# EAGLE schematic Laser Tag Reloaded schematic (EAGLE 6.2)
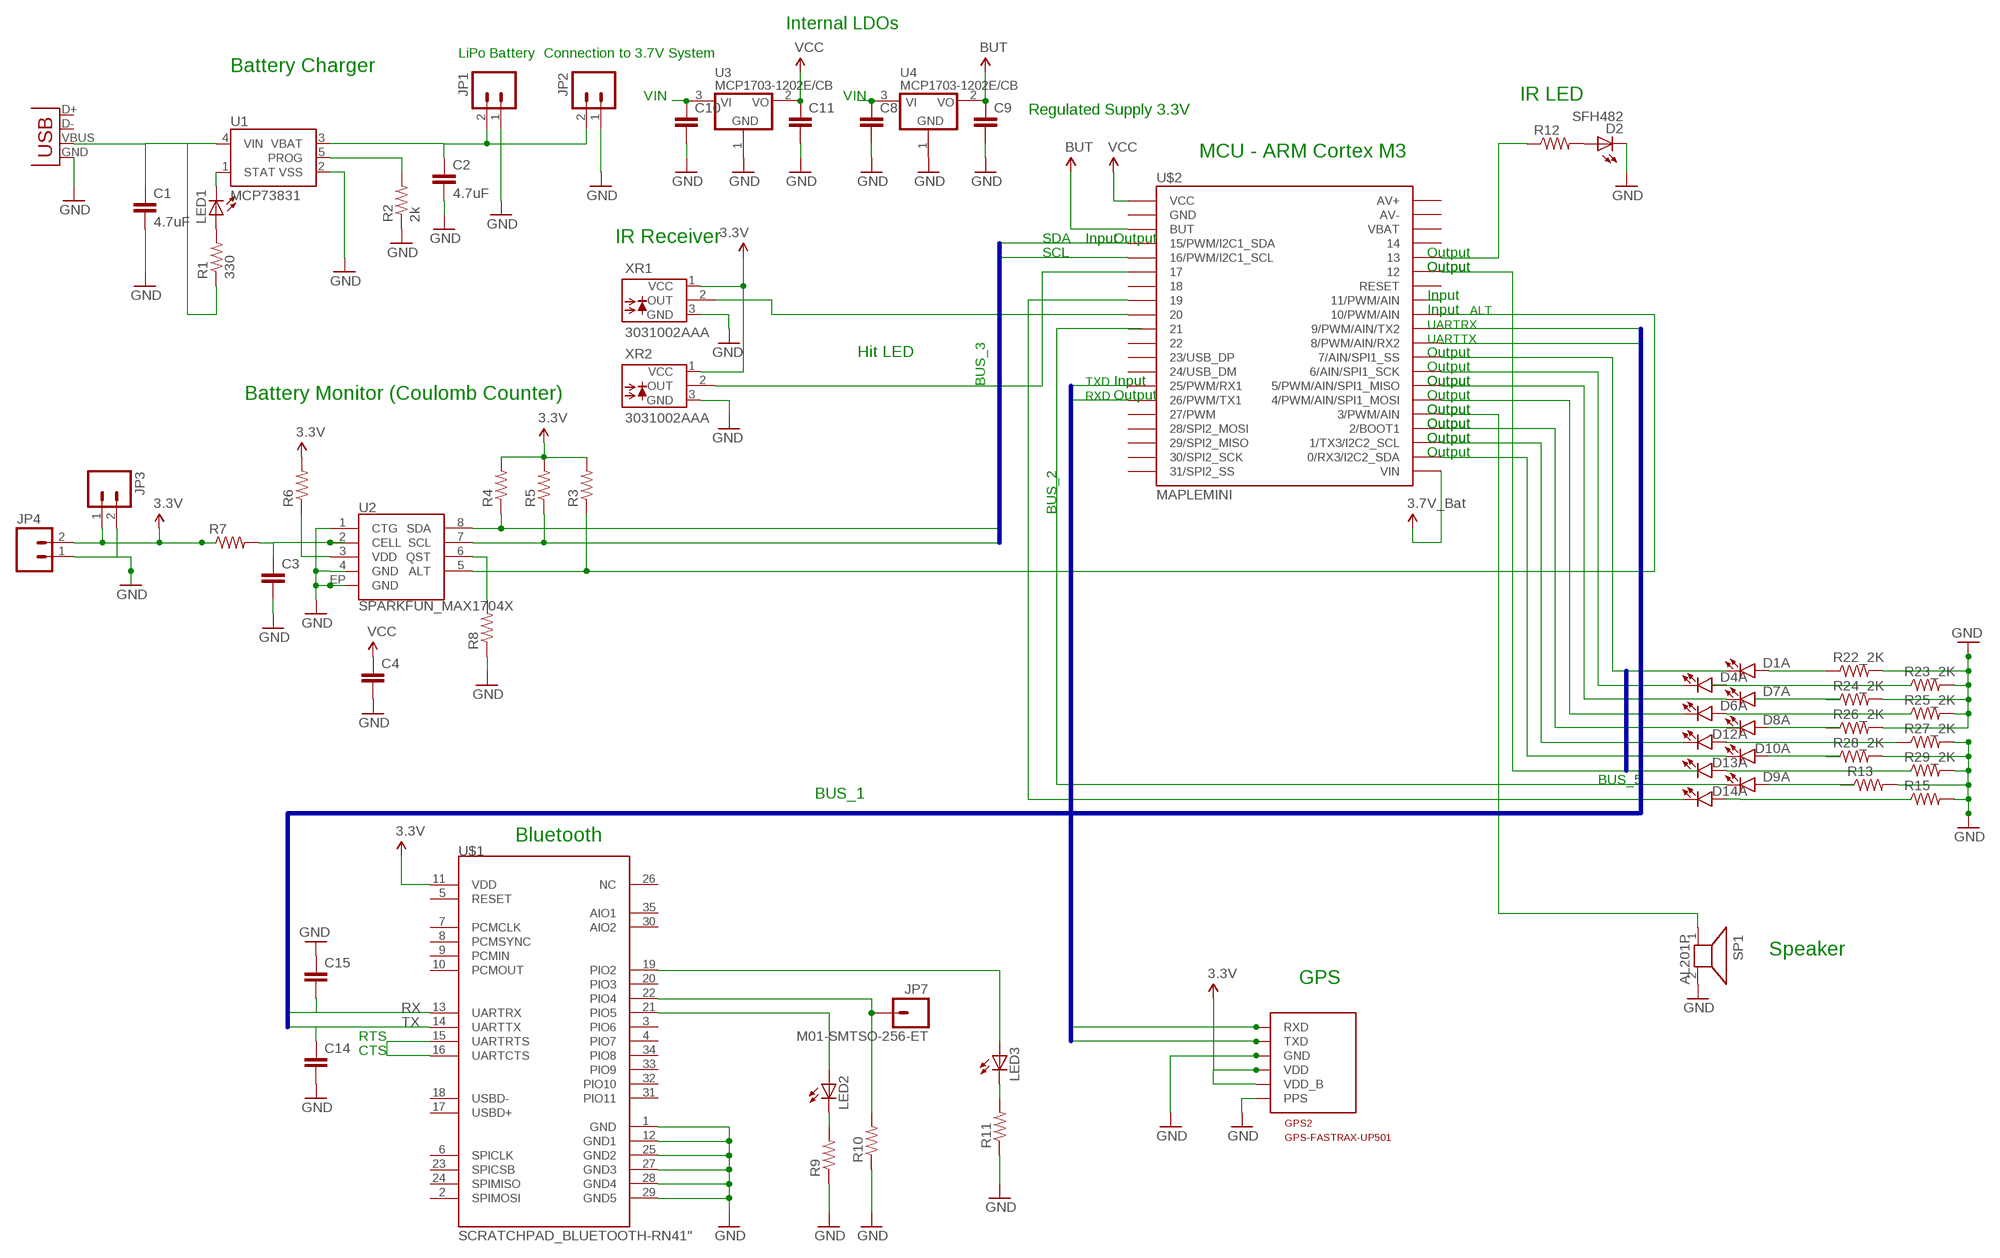
[diagram p0: schematic, sheet 1]

## Parts
C1  4.7uF  SPARKFUN_CAP0402-CAP  [SPARKFUN_0402-CAP]
C2  4.7uF  SPARKFUN_CAP0402-CAP  [SPARKFUN_0402-CAP]
C3  SPARKFUN_CAP0402-CAP  [SPARKFUN_0402-CAP]
C4  SPARKFUN_CAP0402-CAP  [SPARKFUN_0402-CAP]
C8  SPARKFUN_CAP0402-CAP  [SPARKFUN_0402-CAP]
C9  SPARKFUN_CAP0402-CAP  [SPARKFUN_0402-CAP]
C10  SPARKFUN_CAP0402-CAP  [SPARKFUN_0402-CAP]
C11  SPARKFUN_CAP0402-CAP  [SPARKFUN_0402-CAP]
C14  SPARKFUN_CAP0402-CAP  [SPARKFUN_0402-CAP]
C15  SPARKFUN_CAP0402-CAP  [SPARKFUN_0402-CAP]
D1  SPARKFUN_LED_BARGRAPH_10  [SPARKFUN_LED_BARGAPH_10]
D2  SFH482  [SFH482]
D4  SPARKFUN_LED_BARGRAPH_10  [SPARKFUN_LED_BARGAPH_10]
D6  SPARKFUN_LED_BARGRAPH_10  [SPARKFUN_LED_BARGAPH_10]
D7  SPARKFUN_LED_BARGRAPH_10  [SPARKFUN_LED_BARGAPH_10]
D8  SPARKFUN_LED_BARGRAPH_10  [SPARKFUN_LED_BARGAPH_10]
D9  SPARKFUN_LED_BARGRAPH_10  [SPARKFUN_LED_BARGAPH_10]
D10  SPARKFUN_LED_BARGRAPH_10  [SPARKFUN_LED_BARGAPH_10]
D12  SPARKFUN_LED_BARGRAPH_10  [SPARKFUN_LED_BARGAPH_10]
D13  SPARKFUN_LED_BARGRAPH_10  [SPARKFUN_LED_BARGAPH_10]
D14  SPARKFUN_LED_BARGRAPH_10  [SPARKFUN_LED_BARGAPH_10]
GPS2  GPS-FASTRAX-UP501  [GPS-FASTRAX-UP501]
JP1  SPARKFUN_M02-JST-2MM-SMT  [SPARKFUN_JST-2-SMD]
JP2  SPARKFUN_M02-JST-2MM-SMT  [SPARKFUN_JST-2-SMD]
JP3  SPARKFUN_M02-JST-2-PTH-NO_SILK  [SPARKFUN_JST-2-PTH-NS]
JP4  SPARKFUN_M02-JST-2-PTH-NO_SILK  [SPARKFUN_JST-2-PTH-NS]
JP7  M01-SMTSO-256-ET  SPARKFUN_M01-SMTSO-256-ET  [SPARKFUN_SMTSO-256-ET]
LED1  SPARKFUN_LED3MM  [SPARKFUN_LED3MM]
LED2  SPARKFUN_LED3MM  [SPARKFUN_LED3MM]
LED3  SPARKFUN_LED3MM  [SPARKFUN_LED3MM]
R1  330  SPARKFUN_RESISTOR0402-RES  [SPARKFUN_0402-RES]
R2  2k  SPARKFUN_RESISTOR0402-RES  [SPARKFUN_0402-RES]
R3  SPARKFUN_RESISTOR0402-RES  [SPARKFUN_0402-RES]
R4  SPARKFUN_RESISTOR0402-RES  [SPARKFUN_0402-RES]
R5  SPARKFUN_RESISTOR0402-RES  [SPARKFUN_0402-RES]
R6  SPARKFUN_RESISTOR0402-RES  [SPARKFUN_0402-RES]
R7  SPARKFUN_RESISTOR0402-RES  [SPARKFUN_0402-RES]
R8  SPARKFUN_RESISTOR0402-RES  [SPARKFUN_0402-RES]
R9  SPARKFUN_RESISTOR  [SPARKFUN_0805]
R10  SPARKFUN_RESISTOR  [SPARKFUN_0805]
R11  SPARKFUN_RESISTOR  [SPARKFUN_0805]
R12  SPARKFUN_RESISTOR0402-RES  [SPARKFUN_0402-RES]
R13  R-US_0204/2V  [0204V]
R15  R-US_0204/2V  [0204V]
R22_2K  SPARKFUN_RESISTOR0402-RES  [SPARKFUN_0402-RES]
R23_2K  SPARKFUN_RESISTOR0402-RES  [SPARKFUN_0402-RES]
R24_2K  SPARKFUN_RESISTOR0402-RES  [SPARKFUN_0402-RES]
R25_2K  SPARKFUN_RESISTOR0402-RES  [SPARKFUN_0402-RES]
R26_2K  SPARKFUN_RESISTOR0402-RES  [SPARKFUN_0402-RES]
R27_2K  SPARKFUN_RESISTOR0402-RES  [SPARKFUN_0402-RES]
R28_2K  SPARKFUN_RESISTOR0402-RES  [SPARKFUN_0402-RES]
R29_2K  SPARKFUN_RESISTOR0402-RES  [SPARKFUN_0402-RES]
SP1  AL201P  [AL201P]
U1  MCP73831  SPARKFUN_MCP73831  [SPARKFUN_SOT23-5]
U2  SPARKFUN_MAX1704X  [SPARKFUN_TDFN-8]
U3  MCP1703-1202E/CB  [SOT23A_MICROCHIP_CB]
U4  MCP1703-1202E/CB  [SOT23A_MICROCHIP_CB]
U$1  SCRATCHPAD_BLUETOOTH-RN41"  [SCRATCHPAD_RN41]
U$2  MAPLEMINI  [20-DIP]
X2  SPARKFUN_USB-A-S  [SPARKFUN_USB-A-S]
XR1  3031002AAA  [AAA-3]
XR2  3031002AAA  [AAA-3]

## Nets
GND: C1.2 C2.2 C3.2 C4.2 C8.2 C9.2 C10.2 C11.2 C14.2 C15.1 D2.K(C) GPS2.GND GPS2.PPS JP1.1 JP2.1 R2.1 R8.1 R9.1 R10.1 R11.1 R13.2 R15.2 R22_2K.2 R23_2K.2 R24_2K.2 R25_2K.2 R26_2K.2 R27_2K.2 R28_2K.2 R29_2K.2 SP1.2 U1.2(VSS) U2.1(CTG) U2.4(GND) U2.EP(GND) U3.1(GND) U4.1(GND) U$1.1(GND) U$1.12(GND1) U$1.25(GND2) U$1.27(GND3) U$1.28(GND4) U$1.29(GND5) X2.GND XR1.3(GND) XR2.3(GND)
N$1: LED1.A R1.2
N$2: C1.1 R1.1 U1.4(VIN) X2.VBUS
N$3: C2.1 JP1.2 JP2.2 U1.3(VBAT)
N$4: LED1.K(C) U1.1(STAT)
N$5: R2.2 U1.5(PROG)
N$6: R4.1 U2.8(SDA)
N$7: JP3.2 JP4.1 ; supply symbol labelled GND
N$8: C3.1 R7.2 U2.2(CELL)
N$9: R6.1 U2.3(VDD)
N$10: R5.1 U2.7(SCL)
N$11: R8.2 U2.6(QST)
N$12: LED2.K(C) R9.2
N$13: D9.20(A:C)
N$14: LED3.K(C) R11.2
N$15: LED2.A U$1.21(PIO5)
N$16: JP7.P$1 R10.2 U$1.22(PIO4)
N$17: LED3.A U$1.19(PIO2)
N$18: D14.20(A:C) U$2.8
N$19: D14.1(A:A) R15.1
N$20: D1.1(A:A) R22_2K.1
N$22: D6.1(A:A)
N$23: D8.1(A:A)
N$24: D12.1(A:A) R27_2K.1
N$25: GPS2.TXD
N$26: GPS2.RXD
N$28: D2.A R12.2
N$29: U$2.4(15/PWM/I2C1_SDA)
N$30: R12.1 U$2.36
N$31: U$2.5(16/PWM/I2C1_SCL)
N$33: U$2.31(9/PWM/AIN/TX2)
N$34: U$2.30(8/PWM/AIN/RX2)
N$35: U$2.14(25/PWM/RX1)
N$36: U$2.15(26/PWM/TX1)
N$37: D10.1(A:A)
N$38: D13.1(A:A)
N$39: D9.1(A:A)
N$46: D6.20(A:C) U$2.26(4/PWM/AIN/SPI1_MOSI)
N$48: C10.1 U3.3(VI)
N$49: C8.1 U4.3(VI)
N$50: R3.1 U2.5(ALT) U$2.32(10/PWM/AIN)
N$52: D7.20(A:C) U$2.27(5/PWM/AIN/SPI1_MISO)
N$53: D4.20(A:C) U$2.28(6/AIN/SPI1_SCK)
N$54: D1.20(A:C) U$2.29(7/AIN/SPI1_SS)
N$55: SP1.1 U$2.25(3/PWM/AIN)
N$56: U$2.9 XR1.2(OUT)
N$64: U$2.35
N$66: D10.20(A:C) U$2.22(0/RX3/I2C2_SDA)
N$69: R24_2K.1
N$71: U$2.24(2/BOOT1)
N$72: D12.20(A:C) U$2.23(1/TX3/I2C2_SCL)
N$78: U$2.6 XR2.2(OUT)
N$101: U$2.33(11/PWM/AIN)
RTS: U$1.15(UARTRTS) U$1.16(UARTCTS)
RX: C15.2 U$1.13(UARTRX)
TX: C14.1 U$1.14(UARTTX)
VCC: C4.1 C9.1 C11.1 GPS2.VDD GPS2.VDD_B JP3.1 JP4.2 R3.2 R4.2 R5.2 R6.2 R7.1 U3.2(VO) U4.2(VO) U$1.11(VDD) U$2.1(VCC) U$2.3(BUT) U$2.21(VIN) XR1.1(VCC) XR2.1(VCC) ; supply symbol labelled 3.3V, 3.7V_Bat, BUT
Unconnected: D1.2(B:A) D1.3(C:A) D1.4(D:A) D1.5(E:A) D1.6(F:A) D1.7(G:A) D1.8(H:A) D1.9(I:A) D1.10(J:A) D1.11(J:C) D1.12(I:C) D1.13(H:C) D1.14(G:C) D1.15(F:C) D1.16(E:C) D1.17(D:C) D1.18(C:C) D1.19(B:C) D4.1(A:A) D4.2(B:A) D4.3(C:A) D4.4(D:A) D4.5(E:A) D4.6(F:A) D4.7(G:A) D4.8(H:A) D4.9(I:A) D4.10(J:A) D4.11(J:C) D4.12(I:C) D4.13(H:C) D4.14(G:C) D4.15(F:C) D4.16(E:C) D4.17(D:C) D4.18(C:C) D4.19(B:C) D6.2(B:A) D6.3(C:A) D6.4(D:A) D6.5(E:A) D6.6(F:A) D6.7(G:A) D6.8(H:A) D6.9(I:A) D6.10(J:A) D6.11(J:C) D6.12(I:C) D6.13(H:C) D6.14(G:C) D6.15(F:C) D6.16(E:C) D6.17(D:C) D6.18(C:C) D6.19(B:C) D7.1(A:A) D7.2(B:A) D7.3(C:A) D7.4(D:A) D7.5(E:A) D7.6(F:A) D7.7(G:A) D7.8(H:A) D7.9(I:A) D7.10(J:A) D7.11(J:C) D7.12(I:C) D7.13(H:C) D7.14(G:C) D7.15(F:C) D7.16(E:C) D7.17(D:C) D7.18(C:C) D7.19(B:C) D8.2(B:A) D8.3(C:A) D8.4(D:A) D8.5(E:A) D8.6(F:A) D8.7(G:A) D8.8(H:A) D8.9(I:A) D8.10(J:A) D8.11(J:C) D8.12(I:C) D8.13(H:C) D8.14(G:C) D8.15(F:C) D8.16(E:C) D8.17(D:C) D8.18(C:C) D8.19(B:C) D8.20(A:C) D9.2(B:A) D9.3(C:A) D9.4(D:A) D9.5(E:A) D9.6(F:A) D9.7(G:A) D9.8(H:A) D9.9(I:A) D9.10(J:A) D9.11(J:C) D9.12(I:C) D9.13(H:C) D9.14(G:C) D9.15(F:C) D9.16(E:C) D9.17(D:C) D9.18(C:C) D9.19(B:C) D10.2(B:A) D10.3(C:A) D10.4(D:A) D10.5(E:A) D10.6(F:A) D10.7(G:A) D10.8(H:A) D10.9(I:A) D10.10(J:A) D10.11(J:C) D10.12(I:C) D10.13(H:C) D10.14(G:C) D10.15(F:C) D10.16(E:C) D10.17(D:C) D10.18(C:C) D10.19(B:C) D12.2(B:A) D12.3(C:A) D12.4(D:A) D12.5(E:A) D12.6(F:A) D12.7(G:A) D12.8(H:A) D12.9(I:A) D12.10(J:A) D12.11(J:C) D12.12(I:C) D12.13(H:C) D12.14(G:C) D12.15(F:C) D12.16(E:C) D12.17(D:C) D12.18(C:C) D12.19(B:C) D13.2(B:A) D13.3(C:A) D13.4(D:A) D13.5(E:A) D13.6(F:A) D13.7(G:A) D13.8(H:A) D13.9(I:A) D13.10(J:A) D13.11(J:C) D13.12(I:C) D13.13(H:C) D13.14(G:C) D13.15(F:C) D13.16(E:C) D13.17(D:C) D13.18(C:C) D13.19(B:C) D13.20(A:C) D14.2(B:A) D14.3(C:A) D14.4(D:A) D14.5(E:A) D14.6(F:A) D14.7(G:A) D14.8(H:A) D14.9(I:A) D14.10(J:A) D14.11(J:C) D14.12(I:C) D14.13(H:C) D14.14(G:C) D14.15(F:C) D14.16(E:C) D14.17(D:C) D14.18(C:C) D14.19(B:C) R13.1 R23_2K.1 R25_2K.1 R26_2K.1 R28_2K.1 R29_2K.1 U$1.2(SPIMOSI) U$1.3(PIO6) U$1.4(PIO7) U$1.5(RESET) U$1.6(SPICLK) U$1.7(PCMCLK) U$1.8(PCMSYNC) U$1.9(PCMIN) U$1.10(PCMOUT) U$1.17(USBD+) U$1.18(USBD-) U$1.20(PIO3) U$1.23(SPICSB) U$1.24(SPIMISO) U$1.26(NC) U$1.30(AIO2) U$1.31(PIO11) U$1.32(PIO10) U$1.33(PIO9) U$1.34(PIO8) U$1.35(AIO1) U$2.2(GND) U$2.7 U$2.10 U$2.11 U$2.12(23/USB_DP) U$2.13(24/USB_DM) U$2.16(27/PWM) U$2.17(28/SPI2_MOSI) U$2.18(29/SPI2_MISO) U$2.19(30/SPI2_SCK) U$2.20(31/SPI2_SS) U$2.34(RESET) U$2.37 U$2.38(VBAT) U$2.39(AV-) U$2.40(AV+) X2.D+ X2.D-

## Buses
B$1
B$3
B$2
B$5

## Notes on the sheet
- Internal LDOs
- LiPo Battery | Connection to 3.7V System
- Battery Charger
- IR LED
- VIN | VIN
- Regulated Supply 3.3V
- MCU - ARM Cortex M3
- IR Receiver | SDA | Input | Output
- SCL | Output
- Output | Output
- Input
- Input | ALT
- UARTRX
- UARTTX
- Hit LED | Output
- Output
- BUS_3 | TXD | Input | Output | Output
- Battery Monitor (Coulomb Counter) | RXD | Output | Output
- Output | Output
- Output | Output
- Output | Output
- Output
- BUS_2
- BUS_5
- BUS_1
- Bluetooth
- Speaker
- GPS
- RTS
- CTS

## Library data of the parts
C1 C2 = LiPo-Charger-Basic-MiniUSB-v10:SPARKFUN_CAP: Capacitor Standard 0603 ceramic capacitor, and 0.1" leaded capacitor.
C3 C4 C8-C11 C14 C15 = lipo_fuel_gauge-v11:SPARKFUN_CAP: Capacitor Standard 0603 ceramic capacitor, and 0.1" leaded capacitor.
D1 D4 D6-D10 D12-D14 = Bargraph_Breakout_v10:SPARKFUN_LED_BARGRAPH_10: 10-Segment LED Bar Graph SFE part numbers: COM-09935 (red, Vf = 2.1V, Ifmax = 20mA) COM-09936 (yellow, Vf = 2.1V, Ifmax = 20mA) COM-09937 (blue, Vf = 3.4V, Ifmax = 20mA) COM-09938 (green, Vf = 3.4V, Ifmax = 20mA)
D2 = led:SFH482: IR LED infrared emitting diode, Infineon
GPS2 = SteveMarple:GPS-FASTRAX-UP501
JP1 JP2 = LiPo-Charger-Basic-MiniUSB-v10:SPARKFUN_M02: Header 2 Standard 2-pin 0.1" header. Use with straight break away headers (SKU : PRT-00116), right angle break away headers (PRT-00553), swiss pins (PRT-00743), machine pins (PRT-00117), and female headers (PRT-00115). Molex polarized connector foot print use with SKU : PRT-08233 with associated crimp pins and housings.
JP3 JP4 = lipo_fuel_gauge-v11:SPARKFUN_M02: Header 2 Standard 2-pin 0.1" header. Use with straight break away headers (SKU : PRT-00116), right angle break away headers (PRT-00553), swiss pins (PRT-00743), machine pins (PRT-00117), and female headers (PRT-00115). Molex polarized connector foot print use with SKU : PRT-08233 with associated crimp pins and housings.
JP7 = ArduinoBluetoothMatev13:SPARKFUN_M01: Header 1 Standard 1-pin 0.1" header. Use with straight break away headers (SKU : PRT-00116), right angle break away headers (PRT-00553), swiss pins (PRT-00743), machine pins (PRT-00117), and female headers (PRT-00115).
LED1 = LiPo-Charger-Basic-MiniUSB-v10:SPARKFUN_LED: LEDs Standard schematic elements and footprints for 5mm, 3mm, 1206, and 0603 sized LEDs. 5mm - Spark Fun Electronics SKU : COM-00529 (and others)
LED2 LED3 = ArduinoBluetoothMatev13:SPARKFUN_LED: LEDs Standard schematic elements and footprints for 5mm, 3mm, 1206, and 0603 sized LEDs. 5mm - Spark Fun Electronics SKU : COM-00529 (and others)
R1 R2 = LiPo-Charger-Basic-MiniUSB-v10:SPARKFUN_RESISTOR: Resistor
R3-R8 R12 R22_2K R23_2K R24_2K R25_2K R26_2K R27_2K R28_2K R29_2K = lipo_fuel_gauge-v11:SPARKFUN_RESISTOR: Resistor
R9-R11 = ArduinoBluetoothMatev13:SPARKFUN_RESISTOR: Resistor
R13 R15 = resistor:R-US_: RESISTOR, American symbol
SP1 = buzzer:AL201P: SPEAKER Source: Buerklin; OC_FARNELL: unknown; OC_NEWARK: unknown
U1 = LiPo-Charger-Basic-MiniUSB-v10:SPARKFUN_MCP73831: Microchip s MCP73831 Miniature single cell, fully integrated Li-Ion, Li-polymer charge management controller http://ww1.microchip.com/downloads/en/DeviceDoc/21984a.pdf'
U2 = lipo_fuel_gauge-v11:SPARKFUN_MAX1704X: MAX17043/MAX17044: Battery Fuel Guage (43 is 1cell, 44 is 2cell)
U3 U4 = _hhn_MCP1703:MCP1703*02E/CB: MCP1703[A] Series of Voltage Regulators – SOT23A (Microchip CB) (1.2 … 5.0)V, LDO, 16 V Input, 100/150/200/250 mA, Low Quiescent Current Source: http://ww1.microchip.com/downloads/en/DeviceDoc/22049f.pdf http://ww1.microchip.com/downloads/en/DeviceDoc/25122A.pdf Packages: SOT23, Microchip package identifier "CB" (dimensions and recommended land patterns acc. to Microchip) Technologies: MCP1703[A]T-xx02E/CB T : Tape and Reel xx: Output Voltage * 1000 mV; 12|15|18|25|28|30|33|40|50 0 : Extra Feature Code (fixed) 2 : Output volt. Tol.: ±2% (standard) E : Temperature range (−40…+125)°C CB: Package: SOT23A Author: Dipl.-Ing. FH Rainer Bayer HHN Hochschule Heilbronn, rainer.bayer@hs-heilbronn.de Ingenieurbüro ing-rb, mail@ing-rb.de
U$1 = ArduinoBluetoothMatev13:SCRATCHPAD_BLUETOOTH-RN41
U$2 = maplemini:MAPLEMINI
X2 = LiPo-Charger-Basic-MiniUSB-v10:SPARKFUN_USB: USB Connectors USB-B-PTH is fully proven SKU : PRT-00139 USB-miniB is fully proven SKU : PRT-00587 USB-A-PCB is untested. USB-A-H is throughly reviewed, but untested. Spark Fun Electronics SKU : PRT-00437 USB-B-SMT is throughly reviewed, but untested. Needs silkscreen touching up. USB-A-S has not been used/tested USB-MB-H has not been used/tested
XR1 XR2 = opto-honeywell-3000:3031002AAA: OPTO SENSOR DEVICE; OC_FARNELL: unknown; OC_NEWARK: unknown